# EAGLE design replay (EAGLE 6.6.0)
AUTHOR: Joshua Adkins; REV: REV_A; TITLE: Resound-Replay
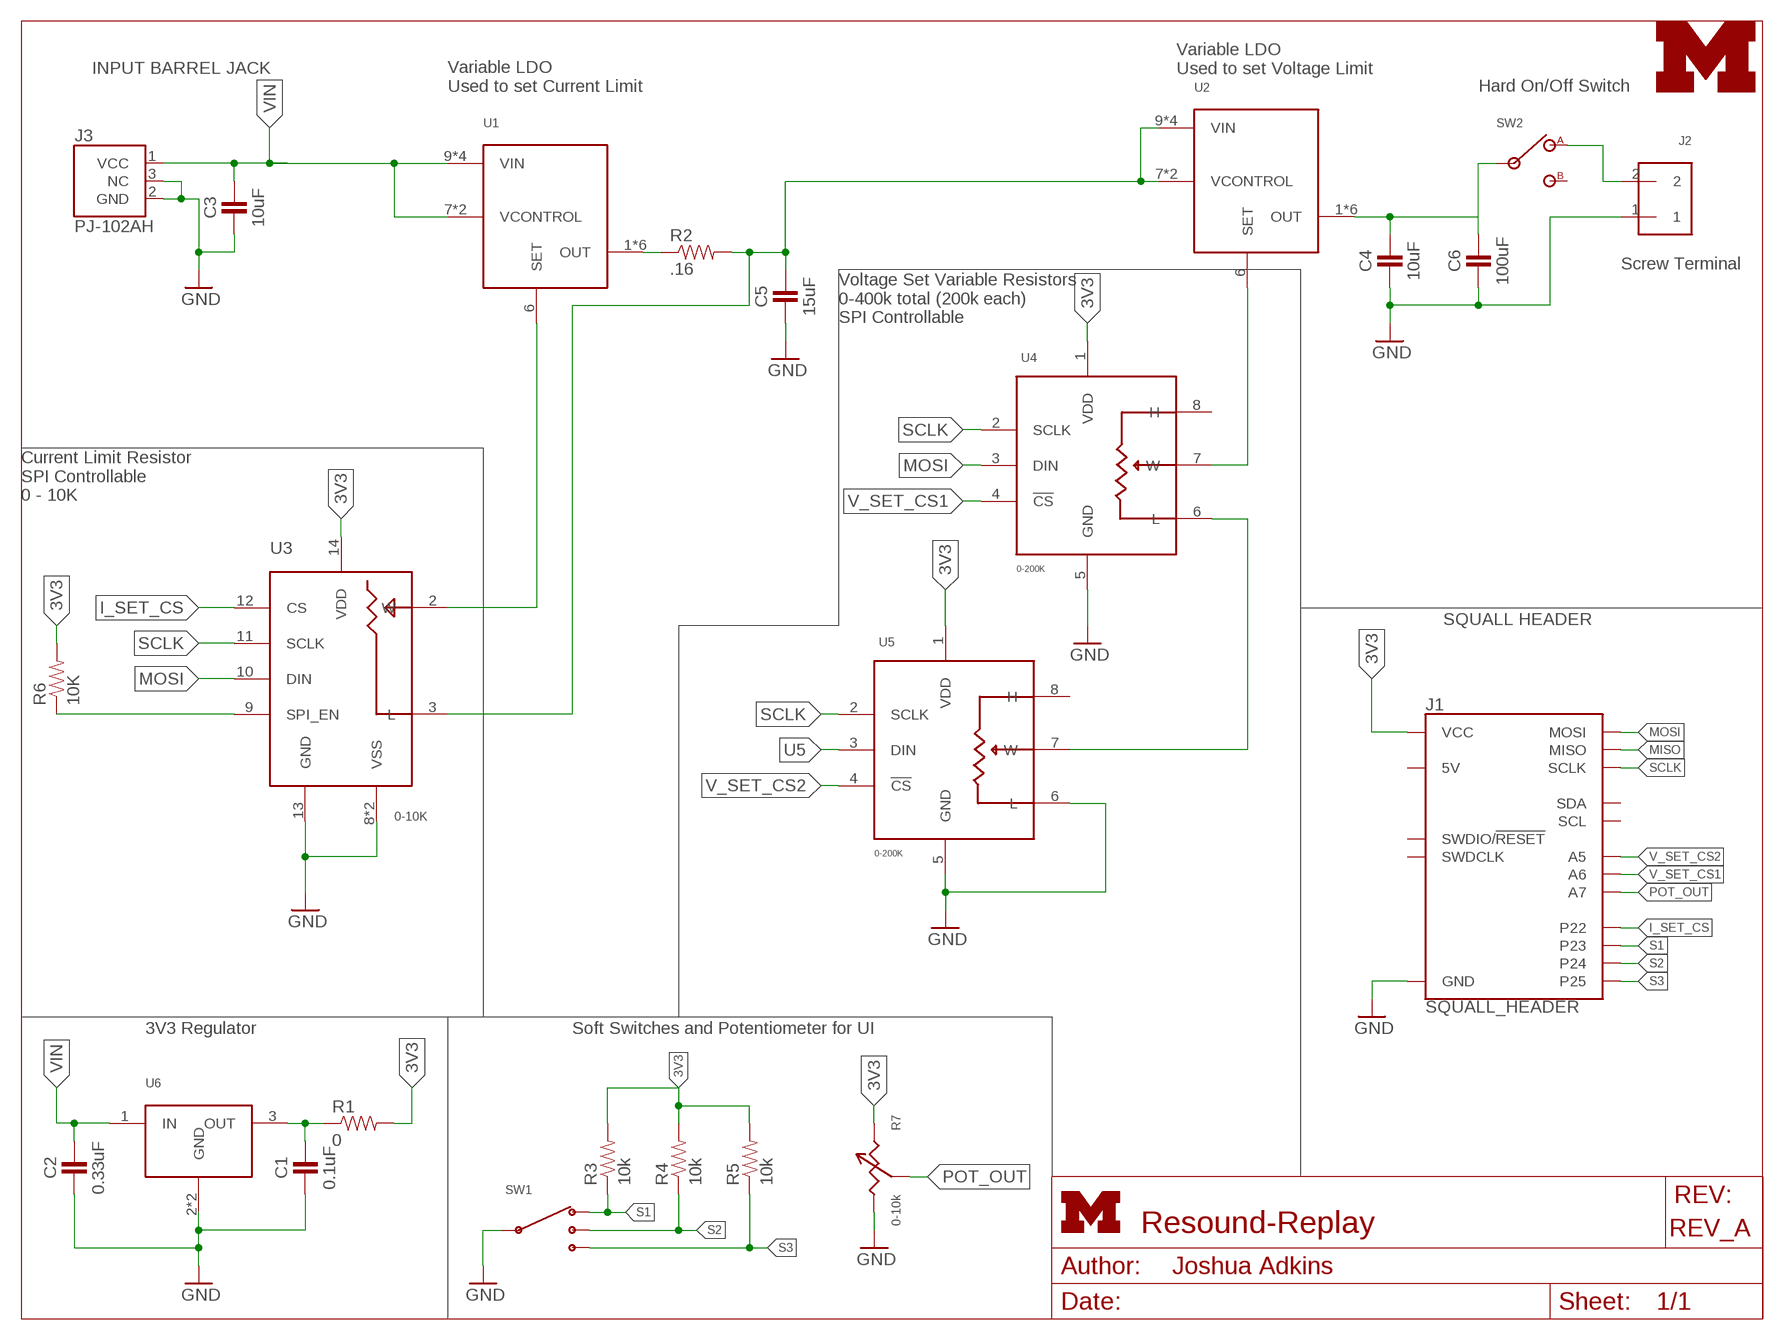
[diagram p0: schematic, sheet 1]
FRAME2 (LETTER_L): HEIGHT: 8.5in; WIDTH: 11in

## Parts
C1  0.1uF  CAPACITOR0603_CAP  [0603_CAP]
C2  0.33uF  CAPACITOR0603_CAP  [0603_CAP]
C3  10uF  CAPACITOR0603_CAP  [0603_CAP]
C4  10uF  CAPACITOR0603_CAP  [0603_CAP]
C5  15uF  CAPACITOR0603_CAP  [0603_CAP]
C6  100uF  CAPACITOR0603_CAP  [0603_CAP]
J1  SQUALL_HEADER  [SQUALL_HEADER]
J2  SCREW_TERMINAL  [PHEONIX-1935161]
J3  PJ-102AH  [PJ-102AH]
LOGO1  UMICH_SOLID_SMALL  [UMICH_SOLID_75MIL]
R1  0  RESISTOR  [0603-RES]
R2  .16  RESISTOR2512  [R2512]
R3  10k  RESISTOR  [0603-RES]
R4  10k  RESISTOR  [0603-RES]
R5  10k  RESISTOR  [0603-RES]
R6  10K  RESISTOR  [0603-RES]
R7  0-10k  POT3310C  [3310C]
SW1  OS103011  [OS103011]
SW2  500ASSP  [500ASSP]
U1  LT3083  [DFN-12/4MM]
U2  LT3083  [DFN-12/4MM]
U3  0-10K  MAX5483  [TQFN-16/3MM]
U4  0-200K  MAX5424  [TDFN-8/3MM]
U5  0-200K  MAX5424  [TDFN-8/3MM]
U6  UA78MXX  [SOT-223]

## Nets
3V3: J1.A1(VCC) J1.A3(VCC) R1.2 R3.2 R4.2 R5.2 R6.2 R7.1 U3.14(VDD) U4.1(VDD) U5.1(VDD)
GND: C1.2 C2.2 C3.2 C4.2 C5.2 C6.2 J1.A9(GND) J1.A10(GND) J2.1 J3.2(GND) J3.3(NC) R7.3 SW1.2(C) U3.8(VSS) U3.13(GND) U3.16(VSS) U4.5(GND) U5.5(GND) U5.6(L) U6.2(GND) U6.4(GND)
I_SET_CS: J1.A2(P22) U3.12(CS)
MISO: J1.B8(MISO)
MOSI: J1.B6(MOSI) U3.10(DIN) U4.3(DIN)
N$3: U1.6(SET) U3.2(W)
N$5: U2.6(SET) U4.7(W)
N$6: U4.6(L) U5.7(W)
N$7: C1.1 R1.1 U6.3(OUT)
N$9: R6.1 U3.9(SPI_EN)
OUT: C4.1 C6.1 SW2.2 U2.1(OUT) U2.2(OUT) U2.3(OUT) U2.4(OUT) U2.5(OUT) U2.13(OUT)
OUT1: R2.1 U1.1(OUT) U1.2(OUT) U1.3(OUT) U1.4(OUT) U1.5(OUT) U1.13(OUT)
OUTS: J2.2 SW2.1
POT_OUT: J1.B5(A7) R7.2
S1: J1.A4(P23) R3.1 SW1.4
S2: J1.A6(P24) R4.1 SW1.3
S3: J1.A8(P25) R5.1 SW1.1
SCLK: J1.B10(SCLK) U3.11(SCLK) U4.2(SCLK) U5.2(SCLK)
U5: U5.3(DIN)
V_SET_CS1: J1.B7(A6) U4.4(!CS)
V_SET_CS2: J1.B9(A5) U5.4(!CS)
VIN: C2.1 C3.1 J3.1(VCC) U1.7(VCONTROL) U1.8(VCONTROL) U1.9(VIN) U1.10(VIN) U1.11(VIN) U1.12(VIN) U6.1(IN)
VIN2: C5.1 R2.2 U2.7(VCONTROL) U2.8(VCONTROL) U2.9(VIN) U2.10(VIN) U2.11(VIN) U2.12(VIN) U3.3(L)
Unconnected: J1.A5(5V) J1.A7(5V) J1.B1(SDA) J1.B2(SWDCLK) J1.B3(SCL) J1.B4(SWDIO/!RESET) SW2.3 U4.8(H) U5.8(H)

## Notes on the sheet
- INPUT BARREL JACK
- Variable LDO
  Used to set Voltage Limit
- Variable LDO
  Used to set Current Limit
- Hard On/Off Switch
- Screw Terminal
- Voltage Set Variable Resistors
  0-400k total (200k each)
  SPI Controllable
- Current Limit Resistor
  SPI Controllable
  0 - 10K
- SQUALL HEADER
- 3V3 Regulator | Soft Switches and Potentiometer for UI

## Library data of the parts
C1-C6 = passives:CAPACITOR: 0402 Capacitor
J1 = squall:SQUALL_HEADER: Header for a sensor board on top of the Squall BLE tag board. Requires two DF40C-10DS-0.4V(51).; DIGIKEY: H11617CT-ND
J2 = connector:SCREW_TERMINAL: PCB terminal block 5mm; DIGIKEY: 277-1667-ND
J3 = connector:PJ-102AH: DC Power Jack 2.0mm / 5.5mm; DIGIKEY: CP-102AH-ND
LOGO1 = logos:UMICH_SOLID
R1 R3-R6 = passives:RESISTOR: Resistor Basic schematic elements and footprints for 0603, 1206, and PTH resistors.
R2 = SparkFun-Passives:RESISTOR: Resistor Basic schematic elements and footprints for 0603, 1206, and PTH resistors.
R7 = pots:POT: Potentiometer; DIGIKEY: 3310C-125-103L-ND
SW1 = switches:OS103011: SP3T right angle switch; DIGIKEY: CKN9561-ND
SW2 = switches:500ASSP: High current slide switch; DIGIKEY: EG2483-ND
U1 U2 = chips:LT3083: 3A resistor programmable LDO; DIGIKEY: LT3083IDF#PBF-ND
U3 = chips:MAX5483: SPI Programmable Rheostat; DIGIKEY: MAX5483ETE+-ND
U4 U5 = chips:MAX5424: Variable POT 256 Tap; DIGIKEY: MAX5424ETA+TCT-ND
U6 = chips:UA78MXX: Wide voltage input range LDO, 500ma, vin=5-25v; DIGIKEY: 296-13424-1-ND

## Board
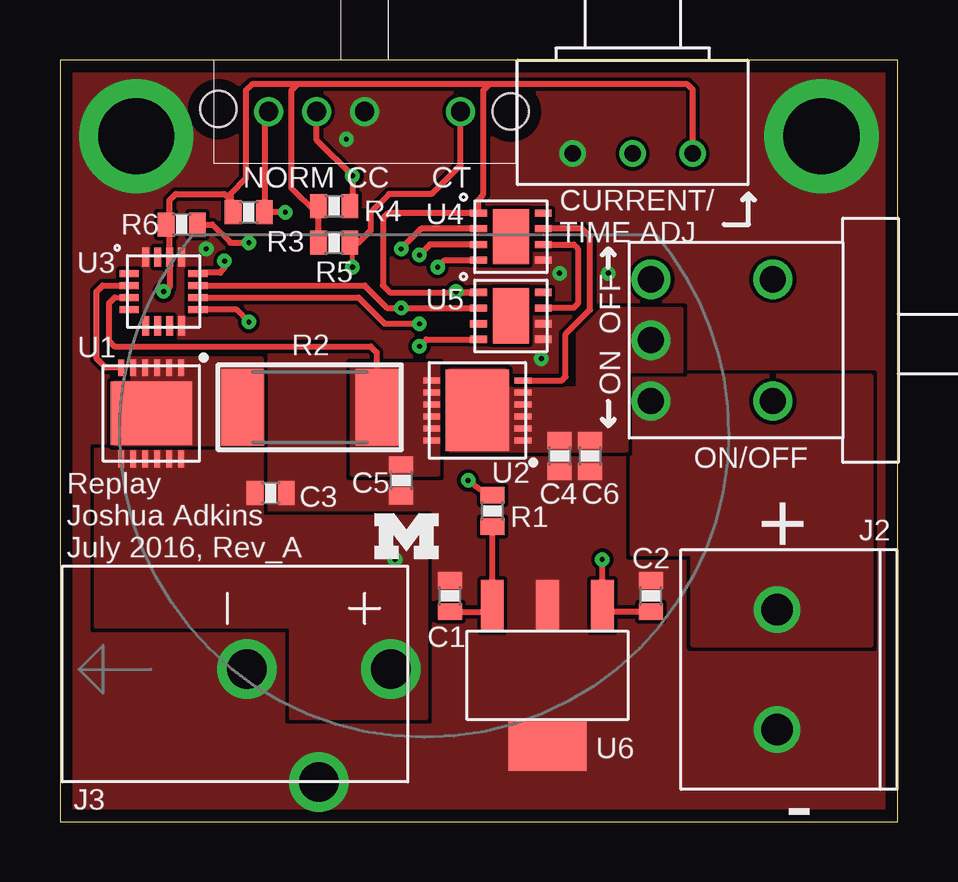
[diagram p1: board, top side]
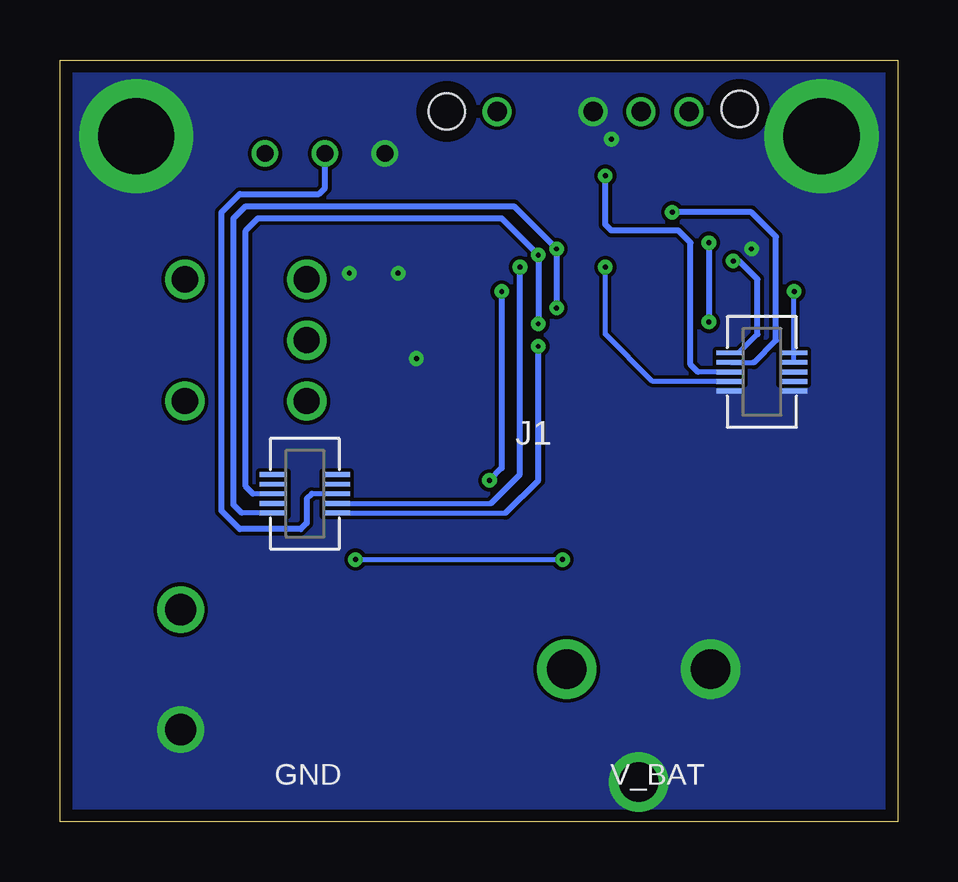
[diagram p2: board, bottom side, seen from below]

Size 34.92 x 31.75 mm. Coordinates in mm from the lower left corner, seen from the top.
Outline: 0,0 34.92,0 34.92,31.75 0,31.75 0,0
Copper layers (1*16): Top 0.0178mm / dielectric 59mil / Bottom 0.0178mm
Design rules "sunstone-2lyr_v1.0.0.3": minimum track width 6mil, minimum drill 14mil, track to track 6mil, track to pad 6mil, pad to pad 6mil, via to via 6mil, smd to smd 6mil, copper to edge 20mil, drill to drill 16mil, minimum pad ring 8mil, minimum via ring 8mil, stop-mask expansion 3mil, vias tented up to drill 50mil, thermal gap 10mil

### Footprints (pad centres in the part's own frame; a part is rotated, then mirrored left to right if it is on the bottom)
0603_CAP = smd 0.7 x 1: 1 -0.65,0; 2 0.65,0
SQUALL_HEADER = smd 1.14 x 0.2 bottom: A1 -10.845,3.34; A2 -8.205,3.34; A3 -10.845,2.94; A4 -8.205,2.94; A5 -10.845,2.54; A6 -8.205,2.54; A7 -10.845,2.14; A8 -8.205,2.14; A9 -10.845,1.74; A10 -8.205,1.74; B1 8.205,-1.74; B2 10.845,-1.74; B3 8.205,-2.14; B4 10.845,-2.14; B5 8.205,-2.54; B6 10.845,-2.54; B7 8.205,-2.94; B8 10.845,-2.94; B9 8.205,-3.34; B10 10.845,-3.34
PHEONIX-1935161 = drill 1.3: 1 0,0; 2 5,0
PJ-102AH = drill 1.65: 1 0,-3; 2 0,3; 3 -4.7,0
0603-RES = smd 0.7 x 1: 1 -0.65,0; 2 0.65,0
R2512 = smd 1.8 x 3.2: 1 -2.8,0; 2 2.8,0
3310C = drill 0.7: 1 -2.5,3.9; 2 0,3.9; 3 2.5,3.9
OS103011 = drill 0.8: 1 -4,0; 2 0,0; 3 2,0; 4 4,0 | hole 1.5: -6.1,0; 6.1,-0.1
500ASSP = drill 1.09: 1 2.54,0; 2 0,0; 3 -2.54,0; P$4 2.54,5.08; P$5 -2.54,5.08
DFN-12/4MM = smd 0.25 x 0.7: 1 -1.25,-1.9; 2 -0.75,-1.9; 3 -0.25,-1.9; 4 0.25,-1.9; 5 0.75,-1.9; 6 1.25,-1.9; 7 1.25,1.9; 8 0.75,1.9; 9 0.25,1.9; 10 -0.25,1.9; 11 -0.75,1.9; 12 -1.25,1.9 | smd 3.38 x 2.65: 13 0,0
TQFN-16/3MM = smd 0.3 x 0.8: 1 -0.75,-1.43; 2 -0.25,-1.43; 3 0.25,-1.43; 4 0.75,-1.43; 9 0.75,1.43; 10 0.25,1.43; 11 -0.25,1.43; 12 -0.75,1.43 | smd 0.8 x 0.3: 5 1.43,-0.75; 6 1.43,-0.25; 7 1.43,0.25; 8 1.43,0.75; 13 -1.43,0.75; 14 -1.43,0.25; 15 -1.43,-0.25; 16 -1.43,-0.75
TDFN-8/3MM = smd 0.3 x 0.7: 1 -0.98,-1.35; 2 -0.33,-1.35; 3 0.33,-1.35; 4 0.98,-1.35; 5 0.98,1.35; 6 0.33,1.35; 7 -0.33,1.35; 8 -0.98,1.35 | smd 2.3 x 1.5: P$9 0,0
SOT-223 = smd 0.95 x 2.15: 1 -2.3,-2.9; 2 0,-2.9; 3 2.3,-2.9 | smd 3.25 x 2.15: 4 0,2.9

### Placement (x,y rotation side)
C1  16.26,9.4 90 top
C2  24.64,9.4 90 top
C3  8.79,13.69 0 top
C4  20.83,15.24 270 top
C5  14.22,14.22 270 top
C6  22.1,15.24 270 top
J1  15.19,16.21 0 top
J2  29.9,3.84 90 top
J3  10.79,6.35 90 top
LOGO1  13.11,10.95 0 top
R1  18.03,12.95 90 top
R2  10.41,17.27 0 top
R3  7.87,25.4 180 top
R4  11.43,25.65 180 top
R5  11.43,24.13 180 top
R6  5.08,24.89 180 top
R7  23.88,31.75 180 top
SW1  12.7,29.6 180 top
SW2  24.64,20.07 270 top
U1  3.81,17.02 180 top
U2  17.4,17.14 90 top
U3  4.32,22.1 270 top
U4  18.8,24.38 270 top
U5  18.8,21.08 270 top
U6  20.32,6.1 180 top

### Tracks (layer width: path | path; a pad name or v marks a point on that pad's centre or on a via)
3V3  (via drill 0.2)
  Top 0.254: 4.57,25.01 U3.14 4.57,22.26 v4.32,22.1 | 4.57,25.01 R6.2 | R5.2 R4.2 10.67,25.4 9.65,26.42 9.65,30.48 9.91,30.73 | 4.57,25.01 4.57,25.9 4.83,26.16 6.86,26.16 7.22,25.8 R3.2 7.11,25.51 7.11,26.16 7.75,26.8 7.75,30.48 8,30.73 9.91,30.73 | R7.1 26.38,30.52 26.16,30.73 17.91,30.73 | 17.91,30.73 9.91,30.73 | 17.91,30.73 17.65,30.48 17.65,26.16 17.45,25.89 U4.1 13.68,25.36 13.46,25.15 13.46,22.35 13.75,22.06 U5.1 16.8,22.06 v16.51,22.1 | v17.02,14.22 17.89,13.6 R1.2
  Bottom 0.203: J1.A1 J1.A3 4.34,22.07
  Bottom 0.254: v4.32,22.1 4.34,22.07 | v16.51,22.1 16.51,14.73 v17.02,14.22
GND  (via drill 0.2, 3.17)
  other vias: 3.17,28.57 31.75,28.57 6.1,23.88 11.94,28.45 20.83,22.86 22.86,22.86 20.07,19.3
  pour Top (rank 6, no thermals): 0,0.05 0,31.78 34.9,31.75 34.9,0.03
  pour Bottom (rank 6, no thermals): 0,0.05 0,31.78 34.9,31.75 34.9,0.03
I_SET_CS  (via drill 0.2)
  Top 0.254: v6.86,23.37 6.86,23.11 6.69,22.88 5.91,22.88 U3.12
  Bottom 0.203: J1.A2 6.62,19.55 5.84,20.32
  Bottom 0.254: 5.84,20.32 5.84,22.61 6.6,23.37 v6.86,23.37
MOSI  (via drill 0.2)
  Top 0.254: U3.10 12.45,21.84 13.54,20.75 v14.99,20.75 | U4.3 15.42,24.05 v14.99,23.62
  Bottom 0.203: J1.B6 26.87,13.66
  Bottom 0.254: v14.99,20.75 v14.99,23.62 16.51,25.15 26.67,25.15 27.18,24.64 27.18,13.97 26.87,13.66
N$3
  Top 0.254: U1.6 1.91,18.92 1.52,19.3 1.52,22.1 1.77,22.35 U3.2
N$5
  Top 0.254: U2.6 20.93,18.39 21.08,18.54 21.08,20.32 22.1,21.34 22.1,24.38 21.77,24.71 U4.7
N$6
  Top 0.254: U4.6 21.41,24.05 21.59,23.88 21.59,21.59 21.41,21.41 U5.7
N$7
  Top 0.254: C1.1 18.02,8.75 U6.3 18.03,9 R1.1
N$9  (via drill 0.2)
  Top 0.254: R6.1 5.73,25 5.84,24.89 6.35,24.89 7.11,24.13 v7.87,24.13 | v7.87,20.83 7.37,21.34 5.76,21.34 U3.9
  Bottom 0.254: v7.87,24.13 v7.87,20.83
OUT
  pour Top (no thermals): 16.26,18.8 16.26,15.49 23.62,15.49 23.62,18.8 25.91,18.8 25.91,21.34 22.61,21.34 21.59,20.32 21.59,18.03 18.54,18.03 18.54,18.8
OUT1
  pour Top (no thermals): 2.29,15.75 2.29,18.29 3.05,18.29 3.05,19.3 8.38,19.3 8.38,15.75
OUTS
  pour Top (rank 2, no thermals): 23.88,11.18 23.88,18.54 33.78,18.54 33.78,7.37 26.42,7.37 26.42,11.18
POT_OUT
  Bottom 0.203: J1.B5 24.43,13.66
  Bottom 0.254: 24.43,13.66 24.64,13.46 24.64,12.45 24.89,12.19 27.43,12.19 28.19,12.95 28.19,25.4 27.43,26.16 24.13,26.16 23.88,26.42 R7.2
S1  (via drill 0.2)
  Top 0.254: v9.4,25.4 R3.1 8.52,29.42 SW1.4
  Bottom 0.203: J1.A4 6,19.14
  Bottom 0.254: 6,19.14 5.08,20.07 5.08,24.38 6.1,25.4 v9.4,25.4
S2  (via drill 0.2)
  Top 0.254: R4.1 12.19,25.51 v12.19,26.92 10.7,28.42 SW1.3
  Bottom 0.203: J1.A6 8.33,18.75
  Bottom 0.254: 8.33,18.75 8.64,19.05 8.64,24.13 9.14,24.64 11.94,24.64 12.19,24.89 v12.19,26.92
S3  (via drill 0.2)
  Top 0.203: v12.19,23.11 12.19,23.76 R5.1
  Top 0.254: R5.1 12.45,24.13 12.95,24.64 12.95,25.4 13.72,26.16 15.49,26.16 16.7,27.37 SW1.1
  Bottom 0.203: J1.A8 10.22,18.34 12.19,20.32 v12.19,23.11
SCLK  (via drill 0.2)
  Top 0.254: U3.11 12.7,22.35 13.64,21.41 v14.22,21.41 U5.2 | U4.2 15.06,24.71 v14.22,23.88
  Bottom 0.203: J1.B10 27.34,12.87
  Bottom 0.254: v14.22,21.41 v14.22,23.88 16,25.65 27.18,25.65 27.69,25.15 27.69,13.21 27.34,12.87
V_SET_CS1  (via drill 0.2)
  Top 0.254: v15.75,23.11 16.04,23.4 U4.4
  Bottom 0.203: J1.B7 16.96,13.27
  Bottom 0.254: 16.96,13.27 15.75,14.48 v15.75,23.11
V_SET_CS2  (via drill 0.2)
  Top 0.254: v14.99,19.81 15.28,20.1 U5.4
  Bottom 0.203: J1.B9 16.34,12.87
  Bottom 0.254: 16.34,12.87 14.99,14.22 v14.99,19.81
VIN  (via drill 0.2)
  Top 0.254: C2.1 22.62,8.75 U6.1 22.62,10.91 v22.61,10.92
  Bottom 0.203: v22.61,10.92 v13.97,10.92
  pour Top (rank 2, no thermals): 1.52,8.13 1.52,15.49 8.38,15.49 8.38,12.7 15.24,12.7 15.24,4.32 9.65,4.32 9.65,8.13
VIN2
  Top 0.203: 2.29,21.85 U3.3
  Top 0.254: 2.29,21.85 2.03,21.59 2.03,20.07 2.29,19.81 12.95,19.81 13.21,19.56 R2.2
  pour Top (no thermals): 12.19,19.05 15.75,19.05 15.75,14.48 12.19,14.48

### Text on the board
tNames: NORM | CC | CT | CURRENT/ / TIME ADJ | OFF | ON | ON/OFF | Replay / Joshua Adkins / July 2016, Rev_A | + | -
bNames: V_BAT | GND